# Altium schematic sheet Lorenz Attractor Schematic.SchDoc
size A
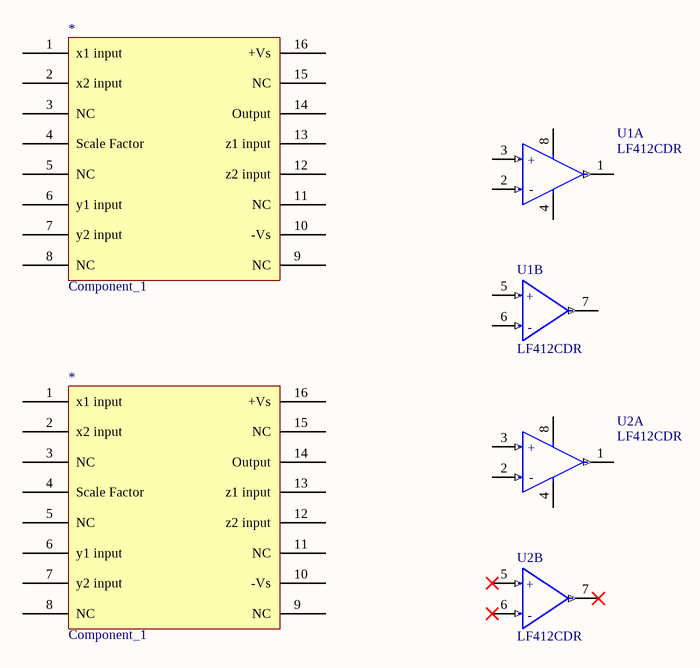
[diagram p0: Lorenz Attractor Schematic.SchDoc]

## Parts
(Parts that share a designator on the sheet are numbered #1, #2 ... from top to bottom, then left to right.)
*#1  Component_1
*#2  Component_1
U1  LF412CDR  [FP-D0008A-MFG]  (parts A,B of 2)
U2  LF412CDR  [FP-D0008A-MFG]  (parts A,B of 2)

## Nets

Not connected (* = marked no-connect by the designer): *#1 1(x1_input) 2(x2_input) 3(NC) 4(Scale_Factor) 5(NC) 6(y1_input) 7(y2_input) 8(NC) 9(NC) 10(-Vs) 11(NC) 12(z2_input) 13(z1_input) 14(Output) 15(NC) 16(+Vs); *#2 1(x1_input) 2(x2_input) 3(NC) 4(Scale_Factor) 5(NC) 6(y1_input) 7(y2_input) 8(NC) 9(NC) 10(-Vs) 11(NC) 12(z2_input) 13(z1_input) 14(Output) 15(NC) 16(+Vs); U1 1(1OUT) 2(1IN-) 3(1IN+) 4(VCC-) 5(2IN+) 6(2IN-) 7(2OUT) 8(VCC+); U2 1(1OUT) 2(1IN-) 3(1IN+) 4(VCC-) 5(2IN+)* 6(2IN-)* 7(2OUT)* 8(VCC+)

## Notes on the sheet
- (in symbol CMP-04895-000010-1, part A) +; -
- (in symbol CMP-04895-000010-1, part B) +; -

## Library data of the parts
U1 U2 = CMP-04895-000010-1: IC OPAMP JFET 3MHZ 8SOIC; Manufacturer: Texas Instruments; Max Dual Supply Voltage: 18V; Input Bias Current: 0.00005uA; Number Of Channels: 2; Voltage Gain: 200V/mV; Input Offset Voltage: 1mV; Nominal Supply Current: 4.5mA; Min Dual Supply Voltage: 3.5V; Standoff Height: 0.11mm; Category: IC; Temperature Range Low: 0°C; Manufacturer Part Number: LF412CDR; Ipc Land Pattern Name: SOIC127P600X175-8; Device Class L2: Linear ICs; Temperature: 0°C to +70°C; Lead Free: Yes; Device Class L3: Amplifiers - Op Amps; Package: D0008A; RoHS: TRUE; ComponentLink2Description: Datasheet; Height: 1.75mm; Mouser Description: Operational Amplifiers - Op Amps Dual JFET Op Amp; Digikey Description: IC OPAMP JFET 3MHZ 8SOIC; Device Class L1: Integrated Circuits (ICs); Automotive: No; Ambient Temperature Range Low: 0°C; Ambient Temperature Range High: +70°C; Gain Bandwidth: 3MHz; Temperature Range High: +70°C; ComponentLink2URL: http://www.ti.com/lit/ds/symlink/lf412.pdf; Octopart: https://octopart.com/lf412cdr-texas+instruments-409258